# Altium project Template, Merged with Variants.PrjPCB
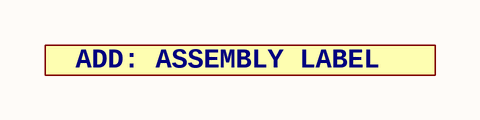
[diagram p0: Sheet1.SchDoc]
P-BOM-Designators_100: PRJ DESIGNATORS-100; P-BOM-Designators_099: PRJ DESIGNATORS-099; P-BOM-Designators_098: PRJ DESIGNATORS-098; P-BOM-Designators_097: PRJ DESIGNATORS-097; P-BOM-Designators_096: PRJ DESIGNATORS-096; P-BOM-Designators_095: PRJ DESIGNATORS-095; P-BOM-Designators_094: PRJ DESIGNATORS-094; P-BOM-Designators_093: PRJ DESIGNATORS-093; P-BOM-Designators_092: PRJ DESIGNATORS-092; P-BOM-Designators_091: PRJ DESIGNATORS-091; P-BOM-Designators_090: PRJ DESIGNATORS-090; P-BOM-Designators_089: PRJ DESIGNATORS-089; P-BOM-Designators_088: PRJ DESIGNATORS-088; P-BOM-Designators_087: PRJ DESIGNATORS-087; P-BOM-Designators_086: PRJ DESIGNATORS-086; P-BOM-Designators_085: PRJ DESIGNATORS-085; P-BOM-Designators_084: PRJ DESIGNATORS-084; P-BOM-Designators_083: PRJ DESIGNATORS-083; P-BOM-Designators_082: PRJ DESIGNATORS-082; P-BOM-Designators_081: PRJ DESIGNATORS-081; P-BOM-Designators_080: PRJ DESIGNATORS-080; P-BOM-Designators_079: PRJ DESIGNATORS-079; P-BOM-Designators_078: PRJ DESIGNATORS-078; P-BOM-Designators_077: PRJ DESIGNATORS-077; P-BOM-Designators_076: PRJ DESIGNATORS-076; P-BOM-Designators_075: PRJ DESIGNATORS-075; P-BOM-Designators_074: PRJ DESIGNATORS-074; P-BOM-Designators_073: PRJ DESIGNATORS-073; P-BOM-Designators_072: PRJ DESIGNATORS-072; P-BOM-Designators_071: PRJ DESIGNATORS-071; P-BOM-Designators_070: PRJ DESIGNATORS-070; P-BOM-Designators_069: PRJ DESIGNATORS-069; P-BOM-Designators_068: PRJ DESIGNATORS-068; P-BOM-Designators_067: PRJ DESIGNATORS-067; P-BOM-Designators_066: PRJ DESIGNATORS-066; P-BOM-Designators_065: PRJ DESIGNATORS-065; P-BOM-Designators_064: PRJ DESIGNATORS-064; P-BOM-Designators_063: PRJ DESIGNATORS-063; P-BOM-Designators_062: PRJ DESIGNATORS-062; P-BOM-Designators_061: PRJ DESIGNATORS-061; P-BOM-Designators_060: PRJ DESIGNATORS-060; P-BOM-Designators_059: PRJ DESIGNATORS-059; P-BOM-Designators_058: PRJ DESIGNATORS-058; P-BOM-Designators_057: PRJ DESIGNATORS-057; P-BOM-Designators_056: PRJ DESIGNATORS-056; P-BOM-Designators_055: PRJ DESIGNATORS-055; P-BOM-Designators_054: PRJ DESIGNATORS-054; P-BOM-Designators_053: PRJ DESIGNATORS-053; P-BOM-Designators_052: PRJ DESIGNATORS-052; P-BOM-Designators_051: PRJ DESIGNATORS-051; P-BOM-Designators_050: PRJ DESIGNATORS-050; P-BOM-Designators_049: PRJ DESIGNATORS-049; P-BOM-Designators_048: PRJ DESIGNATORS-048; P-BOM-Designators_047: PRJ DESIGNATORS-047; P-BOM-Designators_046: PRJ DESIGNATORS-046; P-BOM-Designators_045: PRJ DESIGNATORS-045; P-BOM-Designators_044: PRJ DESIGNATORS-044; P-BOM-Designators_043: PRJ DESIGNATORS-043; P-BOM-Designators_042: PRJ DESIGNATORS-042; P-BOM-Designators_041: PRJ DESIGNATORS-041; P-BOM-Designators_040: PRJ DESIGNATORS-040; P-BOM-Designators_039: PRJ DESIGNATORS-039; P-BOM-Designators_038: PRJ DESIGNATORS-038; P-BOM-Designators_037: PRJ DESIGNATORS-037; P-BOM-Designators_036: PRJ DESIGNATORS-036; P-BOM-Designators_035: PRJ DESIGNATORS-035; P-BOM-Designators_034: PRJ DESIGNATORS-034; P-BOM-Designators_033: PRJ DESIGNATORS-033; P-BOM-Designators_032: PRJ DESIGNATORS-032; P-BOM-Designators_031: PRJ DESIGNATORS-031; P-BOM-Designators_030: PRJ DESIGNATORS-030; P-BOM-Designators_029: PRJ DESIGNATORS-029; P-BOM-Designators_028: PRJ DESIGNATORS-028; P-BOM-Designators_027: PRJ DESIGNATORS-027; P-BOM-Designators_026: PRJ DESIGNATORS-026; P-BOM-Designators_025: PRJ DESIGNATORS-025; P-BOM-Designators_024: PRJ DESIGNATORS-024; P-BOM-Designators_023: PRJ DESIGNATORS-023; P-BOM-Designators_022: PRJ DESIGNATORS-022; P-BOM-Designators_021: PRJ DESIGNATORS-021; P-BOM-Designators_020: PRJ DESIGNATORS-020; P-BOM-Designators_019: PRJ DESIGNATORS-019; P-BOM-Designators_018: PRJ DESIGNATORS-018; P-BOM-Designators_017: PRJ DESIGNATORS-017; P-BOM-Designators_016: PRJ DESIGNATORS-016; P-BOM-Designators_015: PRJ DESIGNATORS-015; P-BOM-Designators_014: PRJ DESIGNATORS-014; P-BOM-Designators_013: PRJ DESIGNATORS-013; P-BOM-Designators_012: PRJ DESIGNATORS-012; P-BOM-Designators_011: PRJ DESIGNATORS-011; P-BOM-Designators_010: PRJ DESIGNATORS-010; P-BOM-Designators_009: PRJ DESIGNATORS-009; P-BOM-Designators_008: PRJ DESIGNATORS-008; P-BOM-Designators_007: PRJ DESIGNATORS-007; P-BOM-Designators_006: PRJ DESIGNATORS-006; P-BOM-Designators_005: PRJ DESIGNATORS-005; P-BOM-Designators_004: PRJ DESIGNATORS-004; P-BOM-Designators_003: PRJ DESIGNATORS-003; P-BOM-Designators_002: PRJ DESIGNATORS-002; P-BOM-Designators_001: PRJ DESIGNATORS-001; P-BOM-Qty_100: PQ100; P-BOM-Qty_099: PQ099; P-BOM-Qty_098: PQ098; P-BOM-Qty_097: PQ097; P-BOM-Qty_096: PQ096; P-BOM-Qty_095: PQ095; P-BOM-Qty_094: PQ094; P-BOM-Qty_093: PQ093; P-BOM-Qty_092: PQ092; P-BOM-Qty_091: PQ091; P-BOM-Qty_090: PQ090; P-BOM-Qty_089: PQ089; P-BOM-Qty_088: PQ088; P-BOM-Qty_087: PQ087; P-BOM-Qty_086: PQ086; P-BOM-Qty_085: PQ085; P-BOM-Qty_084: PQ084; P-BOM-Qty_083: PQ083; P-BOM-Qty_082: PQ082; P-BOM-Qty_081: PQ081; P-BOM-Qty_080: PQ080; P-BOM-Qty_079: PQ079; P-BOM-Qty_078: PQ078; P-BOM-Qty_077: PQ077; P-BOM-Qty_076: PQ076; P-BOM-Qty_075: PQ075; P-BOM-Qty_074: PQ074; P-BOM-Qty_073: PQ073; P-BOM-Qty_072: PQ072; P-BOM-Qty_071: PQ071; P-BOM-Qty_070: PQ070; P-BOM-Qty_069: PQ069; P-BOM-Qty_068: PQ068; P-BOM-Qty_067: PQ067; P-BOM-Qty_066: PQ066; P-BOM-Qty_065: PQ065; P-BOM-Qty_064: PQ064; P-BOM-Qty_063: PQ063; P-BOM-Qty_062: PQ062; P-BOM-Qty_061: PQ061; P-BOM-Qty_060: PQ060; P-BOM-Qty_059: PQ059; P-BOM-Qty_058: PQ058; P-BOM-Qty_057: PQ057; P-BOM-Qty_056: PQ056; P-BOM-Qty_055: PQ055; P-BOM-Qty_054: PQ054; P-BOM-Qty_053: PQ053; P-BOM-Qty_052: PQ052; P-BOM-Qty_051: PQ051; P-BOM-Qty_050: PQ050; P-BOM-Qty_049: PQ049; P-BOM-Qty_048: PQ048; P-BOM-Qty_047: PQ047; P-BOM-Qty_046: PQ046; P-BOM-Qty_045: PQ045; P-BOM-Qty_044: PQ044; P-BOM-Qty_043: PQ043; P-BOM-Qty_042: PQ042; P-BOM-Qty_041: PQ041; P-BOM-Qty_040: PQ040; P-BOM-Qty_039: PQ039; P-BOM-Qty_038: PQ038; P-BOM-Qty_037: PQ037; P-BOM-Qty_036: PQ036; P-BOM-Qty_035: PQ035; P-BOM-Qty_034: PQ034; P-BOM-Qty_033: PQ033; P-BOM-Qty_032: PQ032; P-BOM-Qty_031: PQ031; P-BOM-Qty_030: PQ030; P-BOM-Qty_029: PQ029; P-BOM-Qty_028: PQ028; P-BOM-Qty_027: PQ027; P-BOM-Qty_026: PQ026; P-BOM-Qty_025: PQ025; P-BOM-Qty_024: PQ024; P-BOM-Qty_023: PQ023; P-BOM-Qty_022: PQ022; P-BOM-Qty_021: PQ021; P-BOM-Qty_020: PQ020; P-BOM-Qty_019: PQ019; P-BOM-Qty_018: PQ018; P-BOM-Qty_017: PQ017; P-BOM-Qty_016: PQ016; P-BOM-Qty_015: PQ015; P-BOM-Qty_014: PQ014; P-BOM-Qty_013: PQ013; P-BOM-Qty_012: PQ012; P-BOM-Qty_011: PQ011; P-BOM-Qty_010: PQ010; P-BOM-Qty_009: PQ009; P-BOM-Qty_008: PQ008; P-BOM-Qty_007: PQ007; P-BOM-Qty_006: PQ006; P-BOM-Qty_005: PQ005; P-BOM-Qty_004: PQ004; P-BOM-Qty_003: PQ003; P-BOM-Qty_002: PQ002; P-BOM-Qty_001: PQ001; P-BOM-Desc_100: PRJ DESCRIPTION-100; P-BOM-Desc_099: PRJ DESCRIPTION-099; P-BOM-Desc_098: PRJ DESCRIPTION-098; P-BOM-Desc_097: PRJ DESCRIPTION-097; P-BOM-Desc_096: PRJ DESCRIPTION-096; P-BOM-Desc_095: PRJ DESCRIPTION-095; P-BOM-Desc_094: PRJ DESCRIPTION-094; P-BOM-Desc_093: PRJ DESCRIPTION-093; P-BOM-Desc_092: PRJ DESCRIPTION-092; P-BOM-Desc_091: PRJ DESCRIPTION-091; P-BOM-Desc_090: PRJ DESCRIPTION-090; P-BOM-Desc_089: PRJ DESCRIPTION-089; P-BOM-Desc_088: PRJ DESCRIPTION-088; P-BOM-Desc_087: PRJ DESCRIPTION-087; P-BOM-Desc_086: PRJ DESCRIPTION-086; P-BOM-Desc_085: PRJ DESCRIPTION-085; P-BOM-Desc_084: PRJ DESCRIPTION-084; P-BOM-Desc_083: PRJ DESCRIPTION-083; P-BOM-Desc_082: PRJ DESCRIPTION-082; P-BOM-Desc_081: PRJ DESCRIPTION-081; P-BOM-Desc_080: PRJ DESCRIPTION-080; P-BOM-Desc_079: PRJ DESCRIPTION-079; P-BOM-Desc_078: PRJ DESCRIPTION-078; P-BOM-Desc_077: PRJ DESCRIPTION-077; P-BOM-Desc_076: PRJ DESCRIPTION-076; P-BOM-Desc_075: PRJ DESCRIPTION-075; P-BOM-Desc_074: PRJ DESCRIPTION-074; P-BOM-Desc_073: PRJ DESCRIPTION-073; P-BOM-Desc_072: PRJ DESCRIPTION-072; P-BOM-Desc_071: PRJ DESCRIPTION-071; P-BOM-Desc_070: PRJ DESCRIPTION-070; P-BOM-Desc_069: PRJ DESCRIPTION-069; P-BOM-Desc_068: PRJ DESCRIPTION-068; P-BOM-Desc_067: PRJ DESCRIPTION-067; P-BOM-Desc_066: PRJ DESCRIPTION-066; P-BOM-Desc_065: PRJ DESCRIPTION-065; P-BOM-Desc_064: PRJ DESCRIPTION-064; P-BOM-Desc_063: PRJ DESCRIPTION-063; P-BOM-Desc_062: PRJ DESCRIPTION-062; P-BOM-Desc_061: PRJ DESCRIPTION-061; P-BOM-Desc_060: PRJ DESCRIPTION-060; P-BOM-Desc_059: PRJ DESCRIPTION-059; P-BOM-Desc_058: PRJ DESCRIPTION-058; P-BOM-Desc_057: PRJ DESCRIPTION-057; P-BOM-Desc_056: PRJ DESCRIPTION-056; P-BOM-Desc_055: PRJ DESCRIPTION-055; P-BOM-Desc_054: PRJ DESCRIPTION-054; P-BOM-Desc_053: PRJ DESCRIPTION-053; P-BOM-Desc_052: PRJ DESCRIPTION-052; P-BOM-Desc_051: PRJ DESCRIPTION-051; P-BOM-Desc_050: PRJ DESCRIPTION-050; P-BOM-Desc_049: PRJ DESCRIPTION-049; P-BOM-Desc_048: PRJ DESCRIPTION-048; P-BOM-Desc_047: PRJ DESCRIPTION-047; P-BOM-Desc_046: PRJ DESCRIPTION-046; P-BOM-Desc_045: PRJ DESCRIPTION-045; P-BOM-Desc_044: PRJ DESCRIPTION-044; P-BOM-Desc_043: PRJ DESCRIPTION-043; P-BOM-Desc_042: PRJ DESCRIPTION-042; P-BOM-Desc_041: PRJ DESCRIPTION-041; P-BOM-Desc_040: PRJ DESCRIPTION-040; P-BOM-Desc_039: PRJ DESCRIPTION-039; P-BOM-Desc_038: PRJ DESCRIPTION-038; P-BOM-Desc_037: PRJ DESCRIPTION-037; P-BOM-Desc_036: PRJ DESCRIPTION-036; P-BOM-Desc_035: PRJ DESCRIPTION-035; P-BOM-Desc_034: PRJ DESCRIPTION-034; P-BOM-Desc_033: PRJ DESCRIPTION-033; P-BOM-Desc_032: PRJ DESCRIPTION-032; P-BOM-Desc_031: PRJ DESCRIPTION-031; P-BOM-Desc_030: PRJ DESCRIPTION-030; P-BOM-Desc_029: PRJ DESCRIPTION-029; P-BOM-Desc_028: PRJ DESCRIPTION-028; P-BOM-Desc_027: PRJ DESCRIPTION-027; P-BOM-Desc_026: PRJ DESCRIPTION-026; P-BOM-Desc_025: PRJ DESCRIPTION-025; P-BOM-Desc_024: PRJ DESCRIPTION-024; P-BOM-Desc_023: PRJ DESCRIPTION-023; P-BOM-Desc_022: PRJ DESCRIPTION-022; P-BOM-Desc_021: PRJ DESCRIPTION-021; P-BOM-Desc_020: PRJ DESCRIPTION-020; P-BOM-Desc_019: PRJ DESCRIPTION-019; P-BOM-Desc_018: PRJ DESCRIPTION-018; P-BOM-Desc_017: PRJ DESCRIPTION-017; P-BOM-Desc_016: PRJ DESCRIPTION-016; P-BOM-Desc_015: PRJ DESCRIPTION-015; P-BOM-Desc_014: PRJ DESCRIPTION-014; P-BOM-Desc_013: PRJ DESCRIPTION-013; P-BOM-Desc_012: PRJ DESCRIPTION-012; P-BOM-Desc_011: PRJ DESCRIPTION-011; P-BOM-Desc_010: PRJ DESCRIPTION-010; P-BOM-Desc_009: PRJ DESCRIPTION-009; P-BOM-Desc_008: PRJ DESCRIPTION-008; P-BOM-Desc_007: PRJ DESCRIPTION-007; P-BOM-Desc_006: PRJ DESCRIPTION-006; P-BOM-Desc_005: PRJ DESCRIPTION-005; P-BOM-Desc_004: PRJ DESCRIPTION-004; P-BOM-Desc_003: PRJ DESCRIPTION-003; P-BOM-Desc_002: PRJ DESCRIPTION-002; P-BOM-Desc_001: PRJ DESCRIPTION-001; P-BOM-FR_100: PRJ FR-100; P-BOM-FR_099: PRJ FR-099; P-BOM-FR_098: PRJ FR-098; P-BOM-FR_097: PRJ FR-097; P-BOM-FR_096: PRJ FR-096; P-BOM-FR_095: PRJ FR-095; P-BOM-FR_094: PRJ FR-094; P-BOM-FR_093: PRJ FR-093; P-BOM-FR_092: PRJ FR-092; P-BOM-FR_091: PRJ FR-091; P-BOM-FR_090: PRJ FR-090; P-BOM-FR_089: PRJ FR-089; P-BOM-FR_088: PRJ FR-088; P-BOM-FR_087: PRJ FR-087; P-BOM-FR_086: PRJ FR-086; P-BOM-FR_085: PRJ FR-085; P-BOM-FR_084: PRJ FR-084; P-BOM-FR_083: PRJ FR-083; P-BOM-FR_082: PRJ FR-082; P-BOM-FR_081: PRJ FR-081; P-BOM-FR_080: PRJ FR-080; P-BOM-FR_079: PRJ FR-079; P-BOM-FR_078: PRJ FR-078; P-BOM-FR_077: PRJ FR-077; P-BOM-FR_076: PRJ FR-076; P-BOM-FR_075: PRJ FR-075; P-BOM-FR_074: PRJ FR-074; P-BOM-FR_073: PRJ FR-073; P-BOM-FR_072: PRJ FR-072; P-BOM-FR_071: PRJ FR-071; P-BOM-FR_070: PRJ FR-070; P-BOM-FR_069: PRJ FR-069; P-BOM-FR_068: PRJ FR-068; P-BOM-FR_067: PRJ FR-067; P-BOM-FR_066: PRJ FR-066; P-BOM-FR_065: PRJ FR-065; P-BOM-FR_064: PRJ FR-064; P-BOM-FR_063: PRJ FR-063; P-BOM-FR_062: PRJ FR-062; P-BOM-FR_061: PRJ FR-061; P-BOM-FR_060: PRJ FR-060; P-BOM-FR_059: PRJ FR-059; P-BOM-FR_058: PRJ FR-058; P-BOM-FR_057: PRJ FR-057; P-BOM-FR_056: PRJ FR-056; P-BOM-FR_055: PRJ FR-055; P-BOM-FR_054: PRJ FR-054; P-BOM-FR_053: PRJ FR-053; P-BOM-FR_052: PRJ FR-052; P-BOM-FR_051: PRJ FR-051; P-BOM-FR_050: PRJ FR-050; P-BOM-FR_049: PRJ FR-049; P-BOM-FR_048: PRJ FR-048; P-BOM-FR_047: PRJ FR-047; P-BOM-FR_046: PRJ FR-046; P-BOM-FR_045: PRJ FR-045; P-BOM-FR_044: PRJ FR-044; P-BOM-FR_043: PRJ FR-043; P-BOM-FR_042: PRJ FR-042; P-BOM-FR_041: PRJ FR-041; P-BOM-FR_040: PRJ FR-040; P-BOM-FR_039: PRJ FR-039; P-BOM-FR_038: PRJ FR-038; P-BOM-FR_037: PRJ FR-037; P-BOM-FR_036: PRJ FR-036; P-BOM-FR_035: PRJ FR-035; P-BOM-FR_034: PRJ FR-034; P-BOM-FR_033: PRJ FR-033; P-BOM-FR_032: PRJ FR-032; P-BOM-FR_031: PRJ FR-031; P-BOM-FR_030: PRJ FR-030; P-BOM-FR_029: PRJ FR-029; P-BOM-FR_028: PRJ FR-028; P-BOM-FR_027: PRJ FR-027; P-BOM-FR_026: PRJ FR-026; P-BOM-FR_025: PRJ FR-025; P-BOM-FR_024: PRJ FR-024; P-BOM-FR_023: PRJ FR-023; P-BOM-FR_022: PRJ FR-022; P-BOM-FR_021: PRJ FR-021; P-BOM-FR_020: PRJ FR-020; P-BOM-FR_019: PRJ FR-019; P-BOM-FR_018: PRJ FR-018; P-BOM-FR_017: PRJ FR-017; P-BOM-FR_016: PRJ FR-016; P-BOM-FR_015: PRJ FR-015; P-BOM-FR_014: PRJ FR-014; P-BOM-FR_013: PRJ FR-013; P-BOM-FR_012: PRJ FR-012; P-BOM-FR_011: PRJ FR-011; P-BOM-FR_010: PRJ FR-010; P-BOM-FR_009: PRJ FR-009; P-BOM-FR_008: PRJ FR-008; P-BOM-FR_007: PRJ FR-007; P-BOM-FR_006: PRJ FR-006; P-BOM-FR_005: PRJ FR-005; P-BOM-FR_004: PRJ FR-004; P-BOM-FR_003: PRJ FR-003; P-BOM-FR_002: PRJ FR-002; P-BOM-FR_001: PRJ FR-001; ProjectSchematicTitle2: PS; ProjectSchematicTitle1: PS; ProjectSchematicSheetTotal: PS; ProjectSchematicRevisionDNumber: PS; ProjectSchematicRevisionDDate: PS; ProjectSchematicRevisionDChangeLine2: PS; ProjectSchematicRevisionDChangeLine1: PS; ProjectSchematicRevisionDChange: PS; ProjectSchematicRevisionDBy: PS; ProjectSchematicRevisionCNumber: PS; ProjectSchematicRevisionCDate: PS; ProjectSchematicRevisionCChangeLine2: PS; ProjectSchematicRevisionCChangeLine1: PS; ProjectSchematicRevisionCChange: PS; ProjectSchematicRevisionCBy: PS; ProjectSchematicRevisionBNumber: PS; ProjectSchematicRevisionBDate: PS; ProjectSchematicRevisionBChangeLine2: PS; ProjectSchematicRevisionBChangeLine1: PS; ProjectSchematicRevisionBChange: PS; ProjectSchematicRevisionBBy: PS; ProjectSchematicRevisionANumber: PS; ProjectSchematicRevisionADate: PS; ProjectSchematicRevisionAChangeLine2: PS; ProjectSchematicRevisionAChangeLine1: PS; ProjectSchematicRevisionAChange: PS; ProjectSchematicRevisionABy: PS; ProjectSchematicRegulatoryBlockCheckWIRELESS: PS; ProjectSchematicRegulatoryBlockCheckUL: PS; ProjectSchematicRegulatoryBlockCheckRCM: PS; ProjectSchematicRegulatoryBlockCheckPLENUM: PS; ProjectSchematicRegulatoryBlockCheckNSF: PS; ProjectSchematicRegulatoryBlockCheckKC_KTL: PS; ProjectSchematicRegulatoryBlockCheckINMETRO_NCC: PS; ProjectSchematicRegulatoryBlockCheckIECEx_UL_DEMKO: PS; ProjectSchematicRegulatoryBlockCheckIECEx_ELEMENT: PS; ProjectSchematicRegulatoryBlockCheckIECEx_DEKRA: PS; ProjectSchematicRegulatoryBlockCheckFM: PS; ProjectSchematicRegulatoryBlockCheckCSA: PS; ProjectSchematicRegulatoryBlockCheckCE: PS; ProjectSchematicRegulatoryBlockCheckATEX_UL_DEMKO: PS; ProjectSchematicRegulatoryBlockCheckATEX_ELEMENT: PS; ProjectSchematicRegulatoryBlockCheckATEX_DEKRA_KEMA: PS; ProjectSchematicRegulatoryBlockCheckABS: PS; ProjectSchematicFrNumber: PS; ProjectSchematicDrawnBy: PS; ProjectSchematicDate: PS; ProjectSchematicCheckedBy: PS; ProjectSchematicApprovedBy: PS; ProjectPCBTestpointsTitle2: PT; ProjectPCBTestpointsTitle1: PT; ProjectPCBTestpointsSheetNumber: PT; ProjectPCBPanelTitle2: pp; ProjectPCBPanelTitle1: pp; ProjectPCBPanelSheetNumber: pp; ProjectPCBTitle2: PP; ProjectPCBTitle1: PP; ProjectPCBSheetNumber: PP; ProjectPCBSheetTotal: PP; ProjectPCBRevisionDNumber: PP; ProjectPCBRevisionDDate: PP; ProjectPCBRevisionDChange: PP; ProjectPCBRevisionDBy: PP; ProjectPCBRevisionCNumber: PP; ProjectPCBRevisionCDate: PP; ProjectPCBRevisionCChange: PP; ProjectPCBRevisionCBy: PP; ProjectPCBRevisionBNumber: PP; ProjectPCBRevisionBDate: PP; ProjectPCBRevisionBChange: PP; ProjectPCBRevisionBBy: PP; ProjectPCBRevisionANumber: PP; ProjectPCBRevisionADate: PP; ProjectPCBRevisionAChange: PP; ProjectPCBRevisionABy: PP; ProjectPCBRegulatoryBlockCheckWIRELESS: PP; ProjectPCBRegulatoryBlockCheckUL: PP; ProjectPCBRegulatoryBlockCheckRCM: PP; ProjectPCBRegulatoryBlockCheckPLENUM: PP; ProjectPCBRegulatoryBlockCheckNSF: PP; ProjectPCBRegulatoryBlockCheckKTL: PP; ProjectPCBRegulatoryBlockCheckINMETRO_NCC: PP; ProjectPCBRegulatoryBlockCheckIECEx_UL_DEMKO: PP; ProjectPCBRegulatoryBlockCheckIECEx_ELEMENT: PP; ProjectPCBRegulatoryBlockCheckIECEx_DEKRA: PP; ProjectPCBRegulatoryBlockCheckFM: PP; ProjectPCBRegulatoryBlockCheckCSA: PP; ProjectPCBRegulatoryBlockCheckCE: PP; ProjectPCBRegulatoryBlockCheckATEX_UL_DEMKO: PP; ProjectPCBRegulatoryBlockCheckATEX_ELEMENT: PP; ProjectPCBRegulatoryBlockCheckATEX_DEKRA_KEMA: PP; ProjectPCBRegulatoryBlockCheckABS: PP; ProjectPCBFrNumber: PP; ProjectPCBDrawnBy: PP; ProjectPCBDate: PP; ProjectPCBCheckedBy: PP; ProjectPCBApprovedBy: PP; ProjectAssemblyVersionNumber: PA; ProjectAssemblyTitle2: PA; ProjectAssemblyTitle1: PA; ProjectAssemblySheetNumber: PA; ProjectAssemblySheetTotal: PA; ProjectAssemblyRevisionDNumber: PA; ProjectAssemblyRevisionDDate: PA; ProjectAssemblyRevisionDChange: PA; ProjectAssemblyRevisionDBy: PA; ProjectAssemblyRevisionCNumber: PA; ProjectAssemblyRevisionCDate: PA; ProjectAssemblyRevisionCChange: PA; ProjectAssemblyRevisionCBy: PA; ProjectAssemblyRevisionBNumber: PA; ProjectAssemblyRevisionBDate: PA; ProjectAssemblyRevisionBChange: PA; ProjectAssemblyRevisionBBy: PA; ProjectAssemblyRevisionANumber: PA; ProjectAssemblyRevisionADate: PA; ProjectAssemblyRevisionAChange: PA; ProjectAssemblyRevisionABy: PA; ProjectAssemblyRegulatoryBlockCheckWIRELESS: PA; ProjectAssemblyRegulatoryBlockCheckUL: PA; ProjectAssemblyRegulatoryBlockCheckRCM: PA; ProjectAssemblyRegulatoryBlockCheckPLENUM: PA; ProjectAssemblyRegulatoryBlockCheckNSF: PA; ProjectAssemblyRegulatoryBlockCheckKTL: PA; ProjectAssemblyRegulatoryBlockCheckINMETRO_NCC: PA; ProjectAssemblyRegulatoryBlockCheckIECEx_UL_DEMKO: PA; ProjectAssemblyRegulatoryBlockCheckIECEx_ELEMENT: PA; ProjectAssemblyRegulatoryBlockCheckIECEx_DEKRA: PA; ProjectAssemblyRegulatoryBlockCheckFM: PA; ProjectAssemblyRegulatoryBlockCheckCSA: PA; ProjectAssemblyRegulatoryBlockCheckCE: PA; ProjectAssemblyRegulatoryBlockCheckATEX_UL_DEMKO: PA; ProjectAssemblyRegulatoryBlockCheckATEX_ELEMENT: PA; ProjectAssemblyRegulatoryBlockCheckATEX_DEKRA_KEMA: PA; ProjectAssemblyRegulatoryBlockCheckABS: PA; ProjectAssemblyFrNumber: PA; ProjectAssemblyDrawnBy: PA; ProjectAssemblyDate: PA; ProjectAssemblyCheckedBy: PA; ProjectAssemblyApprovedBy: PA
1 sheet, 1 parts. Net scope: global (net labels, ports and power ports of the same name join across sheets).
Board files: TEMPLATE, PCB, DRAWING, ASSEMBLY.PcbDoc, TEMPLATE, PCB, DRAWING, PCB.PcbDoc, TEMPLATE, PCB, PANEL, 4 LAYER.PcbDoc, TEMPLATE, PCB, SINGLE, 4 LAYER.PcbDoc, TEMPLATE, PCB, TESTPOINTS.PcbDoc

## Sheet Sheet1.SchDoc
size B

### Parts
LABEL1  ADDON, ASSEMBLY LABEL  [HARDWARE, ASSEMBLY LABEL]  (value not drawn)  (no BOM)

### Notes on the sheet
- DATE
- DWN BY
- TITLE
- NO.
- CHANGES
- BY / DATE
- CHKD
- APPD
- DWYER INSTRUMENTS, INC.
- MICHIGAN CITY, INDIANA 46360 U.S.A.
- used except as previously authorized in writing by such corporation and must not be submitted to
- outside parties for examination without the written consent of said corporation.
- NOTICE: this drawing and principles and elements of design embodied therein are the exclusive
- propery of DWYER INSTRUMENTS, INC. and are not to be communicated, disclosed, reproduced or
- FR. NO.
- SIZE B
- ALTIUM DESIGNER
- SHEET
- OF
- (in symbol 2458359.37568) ADD: ASSEMBLY LABEL

### Library data of the parts
LABEL1 = 2458359.37568: Label, Assembly, 0.25" x 0.75"; MFR: A/R; FR Number: None; AVL Description: ** Not in AVL yet **; Key Field: 2458359.37568; MFR No: A/R; RoHS: UNKNOWN

## Assembly variants
Variant 1: all parts fitted
Variant 2: all parts fitted
Variant 3: all parts fitted